# EAGLE board Nosumor (EAGLE 9.5.2)
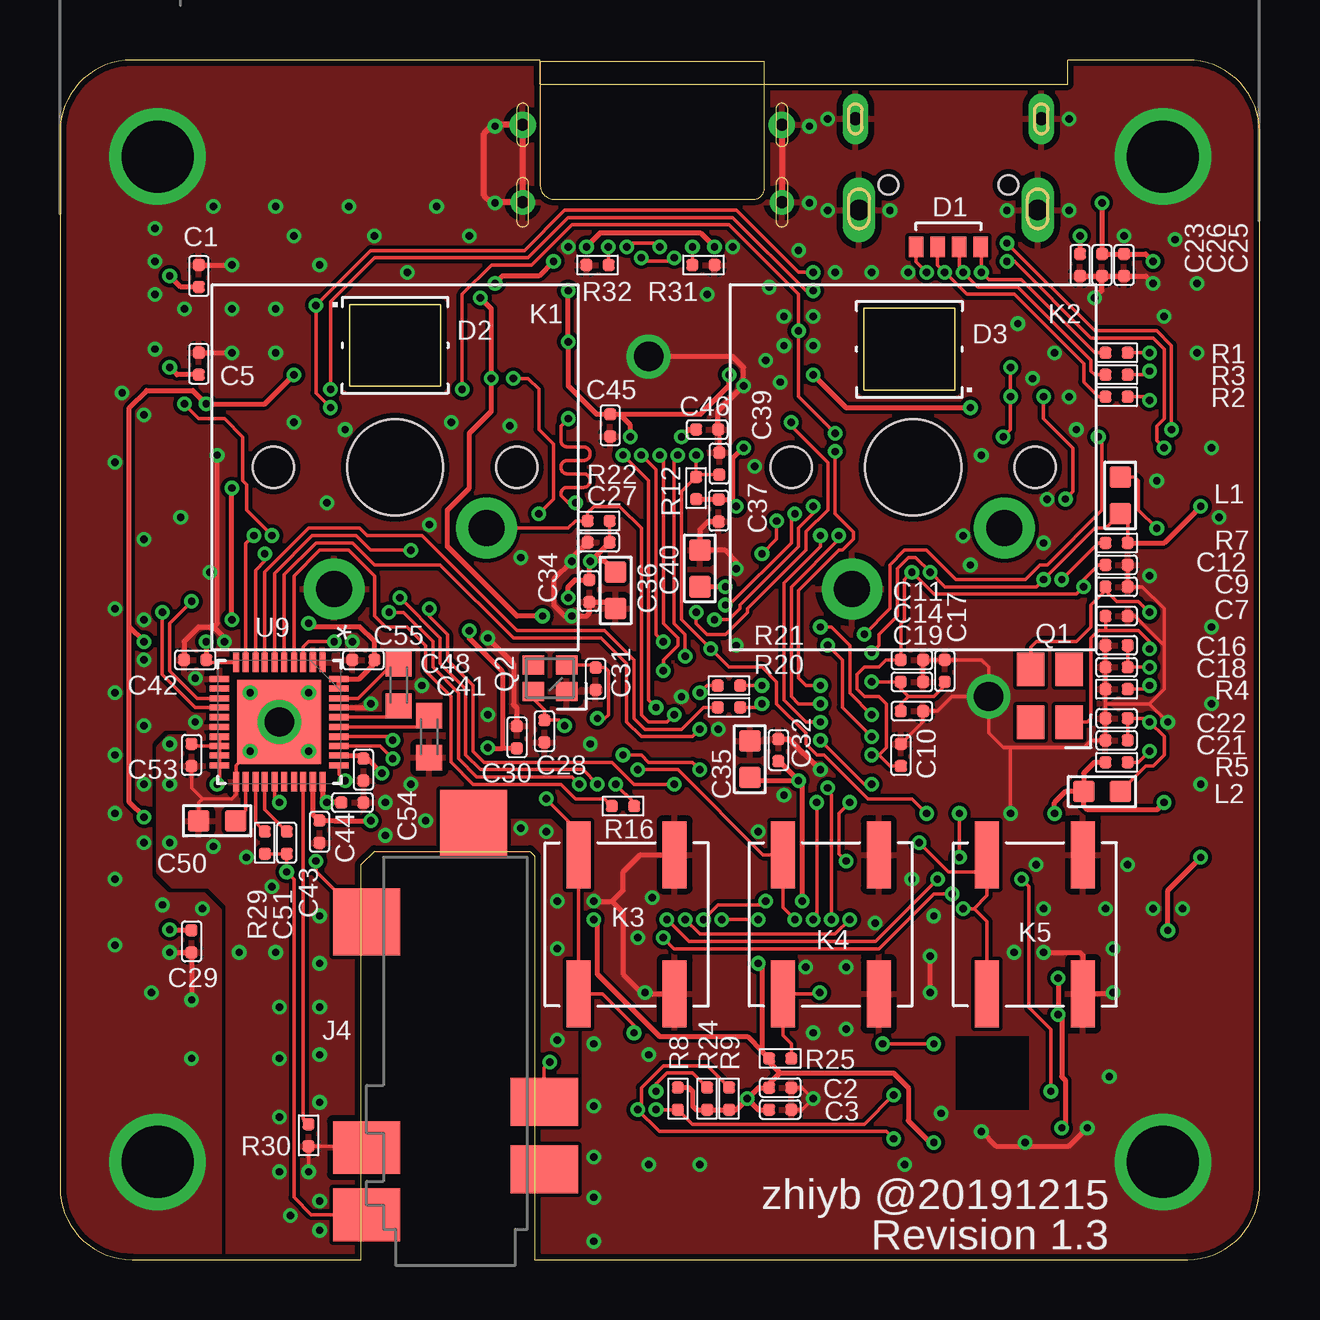
[diagram p1: board, top side]
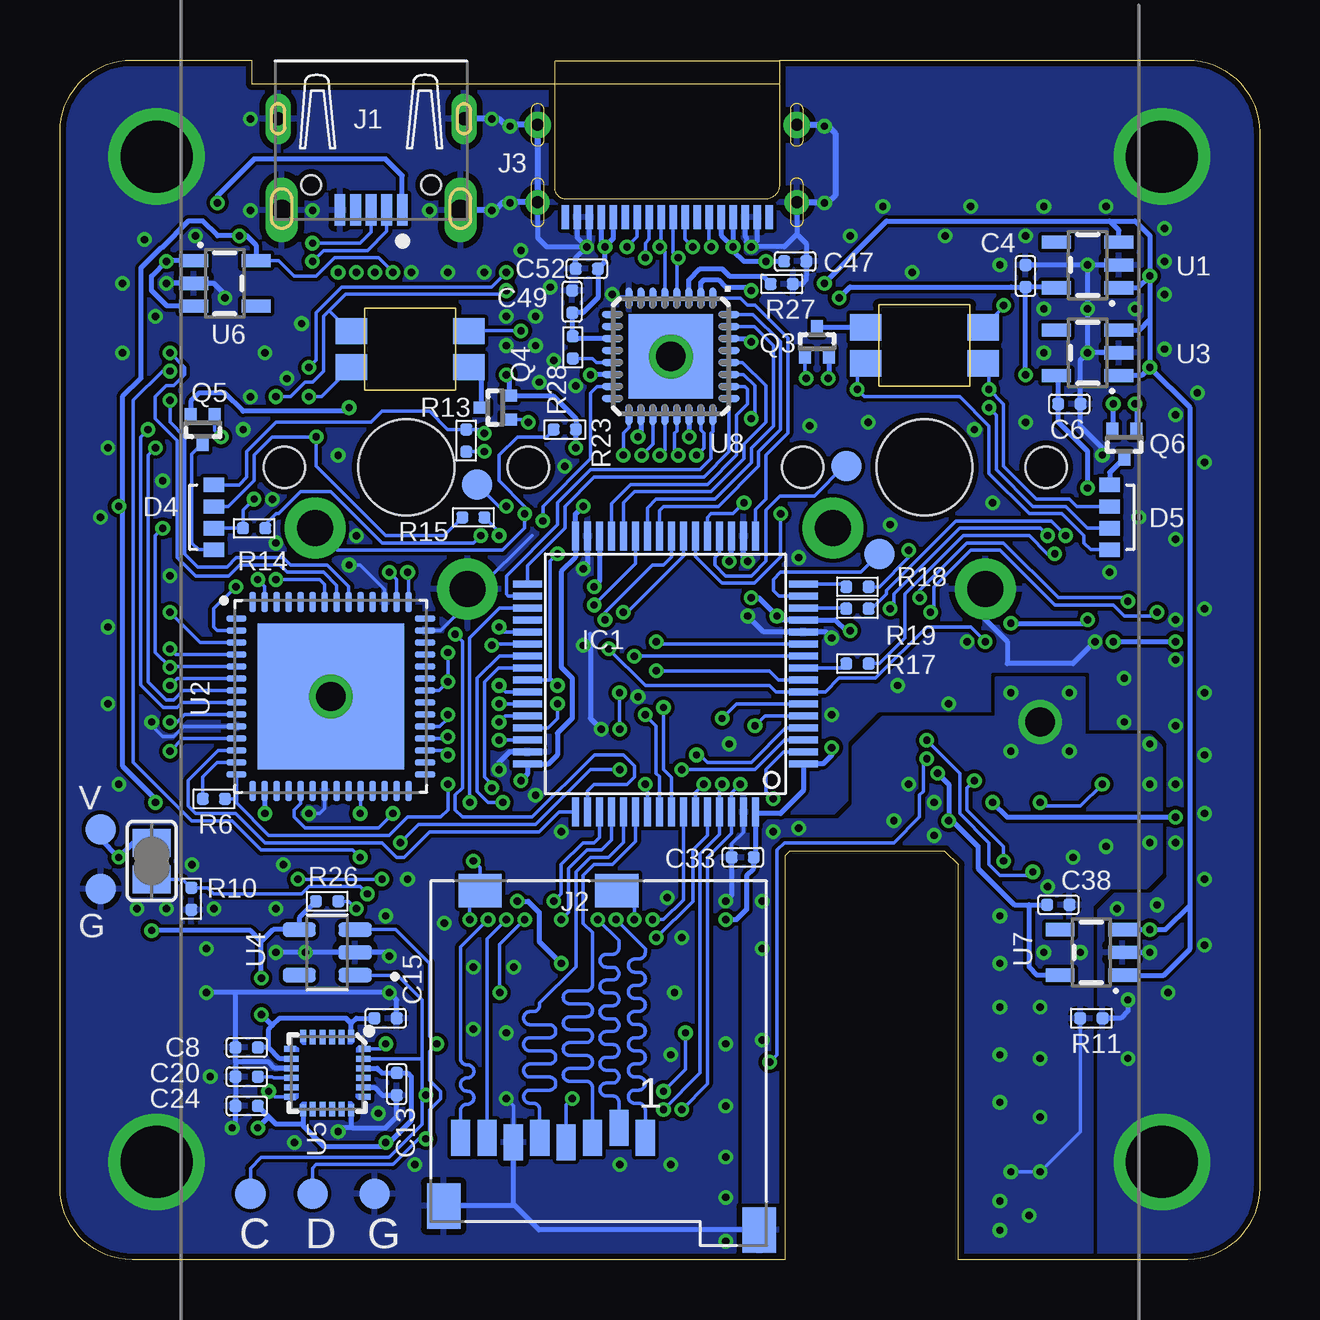
[diagram p2: board, bottom side, seen from below]

Size 50 x 50 mm. Coordinates in mm from the lower left corner, seen from the top.
Outline: 0,3 arc90 3,0 12.55,0 12.55,16.46 13.11,17.02 19.58,17.02 19.79,16.82 19.79,0 47,0 arc90 50,3 50,47 arc90 47,50 42,50 42,49 20,49 20,50 3,50 arc90 0,47 0,3
Copper layers (1*16): Top 0.035mm / dielectric 1.5mm / Bottom 0.035mm
Design rules "SeeedStudio_2layer_DRU_no_angle_20140221": minimum track width 6mil, minimum drill 12mil, track to track 6mil, track to pad 6mil, pad to pad 6mil, via to via 6mil, smd to smd 0mil, copper to edge 10mil, drill to drill 10mil, minimum pad ring 10mil, minimum via ring 6mil, stop-mask expansion 2mil, vias tented up to drill 100mil, thermal gap 10mil
tRestrict: area 37.3,6.2 to 40.4,9.3; area 12.5,0 to 19.8,17.1; area 7,20.3 to 11.3,24.5
bRestrict: area 37.3,6.2 to 40.4,9.3; area 34.9,19.7 to 42.5,27.3; area 22.6,35.2 to 26.8,39.5

## Footprints (pad centres in the part's own frame; a part is rotated, then mirrored left to right if it is on the bottom)
C0402 = smd 0.5 x 0.5: 1 0,0.463; 2 0,-0.463
C0603 = smd 0.889 x 0.889: 1 0,0.762; 2 0,-0.762
C0603K = smd 1.05 x 1.08: 1 -0.875,0; 2 0.875,0
1105 = smd 0.6 x 0.85: B -0.45,0; CA 1.35,0; G 0.45,0; R -1.35,0
HSMF-A3-BACK = smd 1.1 x 1.3 bottom: 1 -0.75,-2.45; 2 -0.75,2.45; 3 0.75,2.45; 4 0.75,-2.45
LQFP64 = smd 0.3 x 1.2: 1 -3.75,-5.75; 2 -3.25,-5.75; 3 -2.75,-5.75; 4 -2.25,-5.75; 5 -1.75,-5.75; 6 -1.25,-5.75; 7 -0.75,-5.75; 8 -0.25,-5.75; 9 0.25,-5.75; 10 0.75,-5.75; 11 1.25,-5.75; 12 1.75,-5.75; 13 2.25,-5.75; 14 2.75,-5.75; 15 3.25,-5.75; 16 3.75,-5.75; 33 3.75,5.75; 34 3.25,5.75; 35 2.75,5.75; 36 2.25,5.75; 37 1.75,5.75; 38 1.25,5.75; 39 0.75,5.75; 40 0.25,5.75; 41 -0.25,5.75; 42 -0.75,5.75; 43 -1.25,5.75; 44 -1.75,5.75; 45 -2.25,5.75; 46 -2.75,5.75; 47 -3.25,5.75; 48 -3.75,5.75 | smd 1.2 x 0.3: 17 5.75,-3.75; 18 5.75,-3.25; 19 5.75,-2.75; 20 5.75,-2.25; 21 5.75,-1.75; 22 5.75,-1.25; 23 5.75,-0.75; 24 5.75,-0.25; 25 5.75,0.25; 26 5.75,0.75; 27 5.75,1.25; 28 5.75,1.75; 29 5.75,2.25; 30 5.75,2.75; 31 5.75,3.25; 32 5.75,3.75; 49 -5.75,3.75; 50 -5.75,3.25; 51 -5.75,2.75; 52 -5.75,2.25; 53 -5.75,1.75; 54 -5.75,1.25; 55 -5.75,0.75; 56 -5.75,0.25; 57 -5.75,-0.25; 58 -5.75,-0.75; 59 -5.75,-1.25; 60 -5.75,-1.75; 61 -5.75,-2.25; 62 -5.75,-2.75; 63 -5.75,-3.25; 64 -5.75,-3.75
629105150521 = smd 0.45 x 1.3: 1 -1.3,3.8; 2 -0.65,3.8; 3 0,3.8; 4 0.65,3.8; 5 1.3,3.8 | drill 0.85 pad 1.2 long: Z1 -3.725,3.8; Z2 3.725,3.8 | drill 0.55 pad 0.9 long: Z3 3.875,0; Z4 -3.875,0 | hole 0.8: -2.5,2.75; 2.5,2.75
693071010811 = smd 0.8 x 1.5: 1 0,0; 2 1.1,-0.4; 3 2.2,0; 4 3.3,0.2; 5 4.4,0; 6 5.5,0.2; 7 6.6,0; 8 7.7,0 | smd 1.4 x 1.9: 9 -4.75,3.85; 9-1 8.4,2.85 | smd 1.8 x 1.4: 10 1.19,-10.3; 10-1 6.89,-10.3
CX90M-16P = smd 0.3 x 1: A1 -3.75,0.75; A4 -2.75,0.75; A5 -1.75,0.75; A6 -0.75,0.75; A7 0.75,0.75; A8 1.75,0.75; A9 2.75,0.75; A12 3.75,0.75; B1 3.25,0.75; B4 2.25,0.75; B5 1.25,0.75; B6 0.25,0.75; B7 -0.25,0.75; B8 -1.25,0.75; B9 -2.25,0.75; B12 -3.25,0.75; NC1 -4.25,0.75; NC2 4.25,0.75 | drill 0.5 pad 1: Z1 5.4,0.13; Z2 -5.4,0.13 | drill 0.5 pad 1.1: Z3 -5.4,-3.1; Z4 5.4,-3.1
SJ-4351*-SMT-MIRRORED-EDGE = smd 2.2 x 2.8: 1 0.6,3.7; 4 3.4,3.7 | smd 2.8 x 2.8: 2 12.8,3.7; 5 16.9,-0.75 | smd 2 x 2.8: 3 5.3,-3.7; 6 2.5,-3.7
CHERRY-MX = drill 1.5 pad 2.54: SW1 -3.81,2.54; SW2 2.54,5.08 | hole 4: 0,0 | hole 1.714: -5.08,0; 5.08,0
KSC-J = smd 2.8 x 1: 1 -2.9,2; 2 -2.9,-2; 3 2.9,2; 4 2.9,-2
L0603 = smd 0.889 x 0.889: 1 -0.762,0; 2 0.762,0
ABM8W = smd 1.4 x 1.15: P$1 0,0; P$2 2.2,0; P$3 2.2,1.6; P$4 0,1.6
CX2016DB = smd 0.9 x 0.8: 1 -0.7,-0.55; 2 0.7,-0.55; 3 0.7,0.55; 4 -0.7,0.55
SC-89 = smd 0.5 x 0.66: 1 -0.5,-0.57; 2 0,0.57; 3 0.5,-0.57
R0402 = smd 0.5 x 0.5: 1 0,0.463; 2 0,-0.463
SJ = smd 1.168 x 1.6: 1 -0.762,0; 2 0.762,0
B1,27 = smd 1.27 x 1.27: TP 0,0
SOT23-5 = smd 0.55 x 1.2: 1 -0.95,-1.3; 2 0,-1.3; 3 0.95,-1.3; 4 0.95,1.3; 5 -0.95,1.3
QFN50P800X800X100-57N = smd 0.85 x 0.27: 1 -3.935,3.25; 2 -3.935,2.75; 3 -3.935,2.25; 4 -3.935,1.75; 5 -3.935,1.25; 6 -3.935,0.75; 7 -3.935,0.25; 8 -3.935,-0.25; 9 -3.935,-0.75; 10 -3.935,-1.25; 11 -3.935,-1.75; 12 -3.935,-2.25; 13 -3.935,-2.75; 14 -3.935,-3.25; 29 3.935,-3.25; 30 3.935,-2.75; 31 3.935,-2.25; 32 3.935,-1.75; 33 3.935,-1.25; 34 3.935,-0.75; 35 3.935,-0.25; 36 3.935,0.25; 37 3.935,0.75; 38 3.935,1.25; 39 3.935,1.75; 40 3.935,2.25; 41 3.935,2.75; 42 3.935,3.25 | smd 0.27 x 0.85: 15 -3.25,-3.935; 16 -2.75,-3.935; 17 -2.25,-3.935; 18 -1.75,-3.935; 19 -1.25,-3.935; 20 -0.75,-3.935; 21 -0.25,-3.935; 22 0.25,-3.935; 23 0.75,-3.935; 24 1.25,-3.935; 25 1.75,-3.935; 26 2.25,-3.935; 27 2.75,-3.935; 28 3.25,-3.935; 43 3.25,3.935; 44 2.75,3.935; 45 2.25,3.935; 46 1.75,3.935; 47 1.25,3.935; 48 0.75,3.935; 49 0.25,3.935; 50 -0.25,3.935; 51 -0.75,3.935; 52 -1.25,3.935; 53 -1.75,3.935; 54 -2.25,3.935; 55 -2.75,3.935; 56 -3.25,3.935 | smd 6.1 x 6.1: 57 0,0
SOT95P280X145-5N = smd 1.39 x 0.6: 1 -1.165,0.95; 2 -1.165,0; 3 -1.165,-0.95; 4 1.165,-0.95; 5 1.165,0.95
QFN24-3X3 = smd 0.495 x 0.25: 1 -1.552,1; 6 -1.552,-1; 13 1.552,-1; 18 1.552,1 | smd 0.6 x 0.25: 2 -1.5,0.6; 3 -1.5,0.2; 4 -1.5,-0.2; 5 -1.5,-0.6; 14 1.5,-0.6; 15 1.5,-0.2; 16 1.5,0.2; 17 1.5,0.6 | smd 0.25 x 0.495: 7 -1,-1.552; 12 1,-1.552; 19 1,1.552; 24 -1,1.552 | smd 0.25 x 0.6: 8 -0.6,-1.5; 9 -0.2,-1.5; 10 0.2,-1.5; 11 0.6,-1.5; 20 0.6,1.5; 21 0.2,1.5; 22 -0.2,1.5; 23 -0.6,1.5
QFN32 = smd 0.9 x 0.3: 1 -2.427,1.75; 2 -2.427,1.25; 3 -2.427,0.75; 4 -2.427,0.25; 5 -2.427,-0.25; 6 -2.427,-0.75; 7 -2.427,-1.25; 8 -2.427,-1.75; 17 2.427,-1.75; 18 2.427,-1.25; 19 2.427,-0.75; 20 2.427,-0.25; 21 2.427,0.25; 22 2.427,0.75; 23 2.427,1.25; 24 2.427,1.75 | smd 0.3 x 0.9: 9 -1.75,-2.427; 10 -1.25,-2.427; 11 -0.75,-2.427; 12 -0.25,-2.427; 13 0.25,-2.427; 14 0.75,-2.427; 15 1.25,-2.427; 16 1.75,-2.427; 25 1.75,2.427; 26 1.25,2.427; 27 0.75,2.427; 28 0.25,2.427; 29 -0.25,2.427; 30 -0.75,2.427; 31 -1.25,2.427; 32 -1.75,2.427 | smd 3.53 x 3.53: EXP 0,0
QFN40P500X500X80-41N = smd 0.813 x 0.254: 1 -2.489,1.803; 2 -2.489,1.397; 3 -2.489,0.991; 4 -2.489,0.61; 5 -2.489,0.203; 6 -2.489,-0.203; 7 -2.489,-0.61; 8 -2.489,-0.991; 9 -2.489,-1.397; 10 -2.489,-1.803; 21 2.489,-1.803; 22 2.489,-1.397; 23 2.489,-0.991; 24 2.489,-0.61; 25 2.489,-0.203; 26 2.489,0.203; 27 2.489,0.61; 28 2.489,0.991; 29 2.489,1.397; 30 2.489,1.803 | smd 0.254 x 0.813: 11 -1.803,-2.489; 12 -1.397,-2.489; 13 -0.991,-2.489; 14 -0.61,-2.489; 15 -0.203,-2.489; 16 0.203,-2.489; 17 0.61,-2.489; 18 0.991,-2.489; 19 1.397,-2.489; 20 1.803,-2.489; 31 1.803,2.489; 32 1.397,2.489; 33 0.991,2.489; 34 0.61,2.489; 35 0.203,2.489; 36 -0.203,2.489; 37 -0.61,2.489; 38 -0.991,2.489; 39 -1.397,2.489; 40 -1.803,2.489 | smd 3.5 x 3.5: 41 0,0

## Placement (x,y rotation side)
C1  4u7  [C0402]  5.79,41 0 top
C2  4u7  [C0402]  30.02,7.16 270 top
C3  100nf  [C0402]  30.02,6.25 90 top
C4  4u7  [C0402]  9.75,41 0 bottom
C5  4u7  [C0402]  5.79,37.34 0 top
C6  4u7  [C0402]  7.92,35.66 270 bottom
C7  4p  [C0402]  44.04,26.82 270 top
C8  100n  [C0402]  42.21,8.84 90 bottom
C9  4p  [C0402]  44.04,28.04 270 top
C10  100nf  [C0402]  35.05,21.03 0 top
C11  4u7  [C0402]  35.51,24.99 270 top
C12  100nf  [C0402]  44.04,28.96 270 top
C13  100n  [C0402]  35.97,7.32 180 bottom
C14  100nf  [C0402]  35.51,24.08 270 top
C15  100n  [C0402]  36.42,10.06 270 bottom
C16  4u7  [C0402]  44.04,25.6 90 top
C17  100nf  [C0402]  36.88,24.54 0 top
C18  100nf  [C0402]  44.04,24.69 90 top
C19  100nf  [C0402]  35.51,22.86 270 top
C20  100n  [C0402]  42.21,7.62 90 bottom
C21  4u7  [C0402]  44.04,21.64 90 top
C22  100nf  [C0402]  44.04,22.56 90 top
C23  4u7  [C0402]  42.52,41.45 180 top
C24  100n  [C0402]  42.21,6.4 90 bottom
C25  4u7  [C0402]  44.35,41.45 180 top
C26  100nf  [C0402]  43.43,41.45 180 top
C27  100n  [C0402]  22.45,29.9 90 top
C28  12pf  [C0402]  20.19,22.02 180 top
C29  4u7  [C0402]  5.49,13.26 180 top
C30  100n  [C0402]  19.05,21.77 0 top
C31  12pf  [C0402]  22.33,24.21 180 top
C32  100n  [C0402]  29.95,21.23 0 top
C33  100n  [C0402]  21.54,16.76 90 bottom
C34  100n  [C0402]  22.07,27.86 180 top
C35  4u7  [C0603]  28.75,20.85 0 top
C36  4u7  [C0603]  23.16,27.89 180 top
C37  100n  [C0402]  27.46,31.22 180 top
C38  4u7  [C0402]  8.38,14.78 270 bottom
C39  100n  [C0402]  27.48,33.17 0 top
C40  4u7  [C0603]  26.67,28.8 0 top
C41  2u2  [C0603K]  15.39,21.79 270 top
C42  100nf  [C0402]  5.64,24.99 90 top
C43  100nf  [C0402]  10.82,17.83 180 top
C44  100nf  [C0402]  12.19,19.05 270 top
C45  4u7  [C0402]  22.94,34.77 180 top
C46  4u7  [C0402]  26.97,34.59 270 top
C47  4u7  [C0402]  19.35,41.61 270 bottom
C48  2u2  [C0603K]  14.12,23.95 90 top
C49  100nf  [C0402]  28.65,39.93 0 bottom
C50  10uf  [C0603]  6.55,18.29 270 top
C51  100nf  [C0402]  9.45,17.37 0 top
C52  100nf  [C0402]  28.04,41.3 90 bottom
C53  100nf  [C0402]  5.49,21.03 0 top
C54  100nf  [C0402]  12.65,20.42 0 top
C55  100nf  [C0402]  12.65,24.99 270 top
D1  MSL0601RGB  [1105]  37.03,42.21 180 top
D2  HSMF-A3-BACK  [HSMF-A3-BACK]  13.97,38.1 270 top
D3  HSMF-A3-BACK  [HSMF-A3-BACK]  35.41,37.95 90 top
D4  MSL0601RGB  [1105]  43.59,30.94 270 bottom
D5  MSL0601RGB  [1105]  6.25,30.94 90 bottom
IC1  STM32F722RET  [LQFP64]  24.77,24.41 90 bottom
J1  [629105150521]  37.03,47.55 180 bottom
J2  [693071010811]  25.6,5.08 180 bottom
J3  CX90M-16P  [CX90M-16P]  24.69,44.2 180 bottom
J4  SJ-43515TS-SMT-EDGE  [SJ-4351*-SMT-MIRRORED-EDGE]  16.48,1.27 90 top
K1  CHERRY-MX  [CHERRY-MX]  13.97,33.02 180 top
K2  CHERRY-MX  [CHERRY-MX]  35.56,33.02 180 top
K3  KSC623J  [KSC-J]  23.62,13.97 90 top
K4  KSC623J  [KSC-J]  32.13,13.97 90 top
K5  KSC623J  [KSC-J]  40.64,13.97 90 top
L1  120OHM-500MA  [L0603]  44.2,31.85 270 top
L2  120OHM-500MA  [L0603]  43.43,19.51 180 top
Q1  ABM8W-12.0000MHZ  [ABM8W]  42.06,22.4 90 top
Q2  CX2016DB  [CX2016DB]  20.42,24.23 0 top
Q3  FDY100PZ  [SC-89]  18.44,38.25 0 bottom
Q4  FDY100PZ  [SC-89]  31.85,35.51 90 bottom
Q5  FDY100PZ  [SC-89]  44.04,34.59 180 bottom
Q6  FDY100PZ  [SC-89]  5.64,33.99 180 bottom
R1  330R  [R0402]  44.04,37.8 270 top
R2  330R  [R0402]  44.04,35.97 270 top
R3  330R  [R0402]  44.04,36.88 270 top
R4  12k 1%  [R0402]  44.04,23.77 270 top
R5  2k2  [R0402]  44.04,20.73 270 top
R6  330R  [R0402]  43.59,19.2 270 bottom
R7  10K 1/16W  [R0402]  44.04,29.87 90 top
R8  2k2  [R0402]  25.76,6.71 180 top
R9  2k2  [R0402]  27.89,6.71 0 top
R10  10K 1/16W  [R0402]  44.53,15.04 0 bottom
R11  0  [R0402]  7.01,10.06 270 bottom
R12  10K 1/16W  [R0402]  26.52,32.16 0 top
R13  100R  [R0402]  33.07,34.14 180 bottom
R14  100R  [R0402]  41.91,30.48 270 bottom
R15  100R  [R0402]  32.77,30.94 270 bottom
R16  27R  [R0402]  23.47,18.9 270 top
R17  27R  [R0402]  16.76,24.84 90 bottom
R18  27R  [R0402]  16.76,28.04 90 bottom
R19  27R  [R0402]  16.76,27.13 90 bottom
R20  27R  [R0402]  27.89,23.01 270 top
R21  10R  [R0402]  27.89,23.93 270 top
R22  10K 1/16W  [R0402]  22.45,30.78 90 top
R23  10K 1/16W  [R0402]  28.96,34.59 90 bottom
R24  10K 1/16W  [R0402]  26.97,6.71 0 top
R25  10K 1/16W  [R0402]  30.02,8.38 270 top
R26  10K 1/16W  [R0402]  38.86,14.94 270 bottom
R27  10K 1/16W  [R0402]  19.91,40.67 270 bottom
R28  20K  [R0402]  28.63,38.02 180 bottom
R29  2k7  [R0402]  8.53,17.37 0 top
R30  0  [R0402]  10.36,5.18 0 top
R31  5k1  [R0402]  26.82,41.45 270 top
R32  5k1  [R0402]  22.4,41.45 90 top
SJ1  [SJ]  46.18,16.61 270 bottom
TP1  TPB1,27  [B1,27]  39.47,2.74 0 bottom
TP2  TPB1,27  [B1,27]  17.22,33.07 0 bottom
TP4  TPB1,27  [B1,27]  48.31,15.44 90 bottom
TP5  TPB1,27  [B1,27]  42.06,2.74 0 bottom
TP6  TPB1,27  [B1,27]  15.85,29.41 0 bottom
TP8  TPB1,27  [B1,27]  48.31,17.93 90 bottom
TP9  TPB1,27  [B1,27]  36.88,2.74 180 bottom
TP10  TPB1,27  [B1,27]  32.61,32.31 0 bottom
U1  3.3V  [SOT23-5]  7.16,41.45 90 bottom
U2  FT2232H-56Q-REEL  [QFN50P800X800X100-57N]  38.71,23.47 0 bottom
U3  1.8V  [SOT23-5]  7.16,37.8 90 bottom
U4  24CW1280T-I/OT  [SOT95P280X145-5N]  38.86,12.8 180 bottom
U5  9DoF IMU  [QFN24-3X3]  38.86,7.77 270 bottom
U6  3.3V  [SOT23-5]  43.13,40.69 270 bottom
U7  1.8V  [SOT23-5]  7.01,12.8 90 bottom
U8  USB3370  [QFN32]  24.54,37.64 270 bottom
U9  TLV320AIC3256  [QFN40P500X500X80-41N]  9.14,22.4 270 top

## Tracks (layer width: path | path; a pad name or v marks a point on that pad's centre or on a via)
+1V8  (via drill 0.3)
  Top 0.203: U9.39 U9.40 12.47,24.21 13.11,24.85 C55.1 13.11,25.75 12.5,26.36 10.52,26.36 v10.36,26.52 | v7.16,26.67 v7.16,32.16
  Bottom 0.203: U3.5 8.39,36.77 C6.2 8.39,34.91 7.16,33.68 v7.16,32.16 | v10.36,26.52 7.32,26.52 v7.16,26.67
+3V3  (via drill 0.3)
  Top 0.152: R22.2 C27.2 | U9.10 6.2,24.89 C42.2
  Top 0.203: 22.13,29.11 v22.1,29.11 22.07,29.08 C34.2 21.47,28.33 21.18,28.04 v21.18,27.58 | 22.13,29.11 C27.2 | R12.2 26.53,31.68 C37.2 28.02,31.68 28.04,31.7 | C36.2 22.71,29.11 22.13,29.11 | v30.79,19.96 29.98,20.77 C32.2 | C35.2 28.88,19.96 v30.79,19.96 | v31.39,36.88 32.77,35.51 v37.95,35.51 | v28.65,6.71 29.11,7.16 C2.2 29.56,7.32 30.02,7.77 | v28.65,6.71 29.11,6.25 C3.1 | R8.2 26.21,7.17 26.36,7.01 26.36,6.4 26.52,6.24 R24.2 27.87,6.24 27.88,6.25 R9.2 28.19,6.24 v28.65,6.71 | v17.07,26.21 17.07,25.88 18.44,24.51 18.44,21.3 | C30.2 18.44,21.3 | 18.44,21.3 17.86,21.3 v17.83,21.34 | U9.30 10.95,19.23 v11.12,19.05 C44.2 | v30.79,19.96 30.94,19.81 v30.94,14.94 | v29.11,12.34 29.26,12.19 29.26,8.68 | 29.26,8.68 R25.2 29.56,8.23 30.02,7.77 | v22.25,14.17 22.4,14.02 22.4,11.89 24.99,9.3 28.65,9.3 29.26,8.68 | v17.53,40.08 17.98,39.62 v17.98,36.73 17.98,35.36 17.07,34.44 17.07,32.16 16.15,31.24 16.15,29.72 19.05,26.82 v20.12,26.82 | v9.75,36.88 8.53,35.66 v6.1,35.66 5.54,36.22 3.61,36.22 2.9,35.51 2.9,26.36 | v6.1,25.76 v6.1,25.75 C42.2 | v28.5,33.83 28.04,33.38 28.04,31.7 | v28.19,31.39 28.04,31.55 28.04,31.7 | v41.76,5.49 41.91,5.64 41.91,7.47 41.76,7.62 41.76,10.06 v41.6,10.21 v41.6,11.73 | 30.02,7.77 34.75,7.77 35.36,7.16 35.36,5.79 36.35,4.8 v36.42,4.88 | 2.9,26.36 2.9,19.05 v3.5,18.44 | v3.5,25.76 2.9,26.36 | v46.18,13.72 46.18,15.39 v47.55,16.76
  Bottom 0.152: J2.4 28.9,6.45 v28.65,6.71
  Bottom 0.203: v22.1,29.11 22.02,29.19 IC1.19 | v28.19,31.39 28.52,31.07 IC1.32 28.52,29.27 29.11,28.67 29.11,24.69 28.65,24.23 28.65,22.55 29.26,21.95 29.26,21.03 29.63,20.66 IC1.48 30.52,20.23 v30.79,19.96 | v28.5,33.83 v28.49,33.84 R23.2 28.49,35.05 29.46,36.01 Q4.3 31.28,36.77 v31.39,36.88 | v37.95,35.51 38.1,35.36 42.37,35.36 43.13,36.12 44.2,36.12 44.54,35.77 Q5.3 | v17.07,26.21 17.22,26.21 17.67,26.66 IC1.13 19.95,26.66 v20.12,26.82 20.88,27.58 v21.18,27.58 | v17.83,21.34 17.83,21.03 18.2,20.66 IC1.1 19.02,19.54 19.96,18.59 21.02,18.59 | v30.94,14.94 30.48,14.94 30.02,14.48 30.02,13.26 v29.11,12.34 | v22.25,14.17 21.79,14.17 21.38,14.59 21.38,16 21.08,16.31 C33.2 21.02,16.83 21.02,18.59 | IC1.64 21.02,18.59 | Q3.3 17.94,36.77 v17.98,36.73 | v17.53,40.08 17.07,40.54 10.36,40.54 10.36,40.53 C4.2 | U1.5 8.49,40.53 C4.2 | Q6.3 6.1,34.6 v6.1,35.66 | v9.75,36.88 C4.2 | v11.12,19.05 10.52,18.44 v3.5,18.44 | U5.22 36.78,7.97 36.58,7.78 C13.2 35.51,7.78 35.36,7.62 35.36,5.79 36.35,4.8 v36.42,4.88 36.58,4.72 39.01,4.72 39.86,5.57 39.86,5.64 | U5.8 40.83,8.37 41.3,8.84 | 41.3,8.84 C8.2 | U5.13 39.86,5.64 | C24.2 41.3,5.95 | U5.1 37.86,9.84 | 37.86,9.84 37.64,10.06 C15.2 | 37.86,9.84 38.08,10.06 40.84,10.06 41.15,9.75 | 41.3,8.84 41.3,9.6 41.15,9.75 | 41.15,9.75 v41.6,10.21 | v41.76,5.49 41.3,5.95 | R26.2 40.03,14.23 U4.4 41.11,13.75 41.6,13.26 | v41.6,11.73 41.6,13.26 | 41.6,13.26 42.06,13.72 v46.18,13.72 | 41.3,5.95 40.99,5.64 39.86,5.64 | v6.1,25.76 v3.5,25.76 | SJ1.1 46.94,17.37 v47.55,16.76 48.31,17.53 TP8.TP
+5V  (via drill 0.3)
  Top 0.203: v20.57,41.6 19.96,41 18.44,41 v18.14,40.69 | C1.2 5.04,40.53 v4.57,41 | C5.2 4.88,36.88 v4.57,37.19 | C29.2 4.6,13.72 v4.57,13.75 | v21.95,42.22 22.53,42.8 26.7,42.8 v27.28,42.22
  Bottom 0.203: J3.B9 22.44,42.71 v21.95,42.22 | J3.A4 v21.95,42.22 | J3.B4 26.94,42.56 v27.28,42.22 | J3.A9 27.44,42.37 v27.28,42.22 | v27.28,42.22 27.28,41.6 C52.2 27.58,40.09 28.2,39.47 C49.2 28.63,39.44 R28.2 28.53,38.39 U8.11 | v21.95,42.22 21.95,42.06 21.49,41.6 v20.57,41.6 C47.2 | v18.14,40.69 15.54,43.28 6.25,43.28 | v4.57,41 4.57,42.67 5.18,43.28 6.25,43.28 | v4.57,41 4.57,39.17 | 4.57,39.17 v4.57,37.19 | U3.1 4.91,36.84 v4.57,37.19 | U1.1 5.07,40.5 v4.57,41 | U7.3 v4.57,13.75 3.93,13.75 2.9,14.78 | v4.57,37.19 2.9,35.51 2.9,14.78 | 2.9,14.78 2.9,12.95 4,11.85 U7.1 | U3.3 4.99,38.74 4.57,39.17 | U1.3 5.86,42.9 6.25,43.28
ADC1
  Bottom 0.152: IC1.15 20.04,27.66 20.27,27.89 20.27,28.35 19.96,28.65 16.61,28.65 TP6.TP
ADC2  (via drill 0.3)
  Top 0.152: v27.28,26.67 27.89,26.67 28.35,27.13 28.35,27.28 30.79,29.72 30.79,30.48 31.39,31.09 v31.39,31.39
  Bottom 0.152: IC1.24 24.52,29.28 24.84,28.96 25.3,28.96 27.28,26.98 v27.28,26.67 | v31.39,31.39 31.7,31.39 TP10.TP
AGND  (via drill 0.3, 1.22)
  Top 0.152: U9.41 7.34,20.6 U9.21 7.34,19.38 7.16,19.2 5.94,19.2 | 5.94,19.2 5.79,19.05 C50.2 | C53.2 5.49,19.66 5.94,19.2 | J4.4 12.74,4.72 R30.2 v10.36,3.66
  Bottom 0.152: v10.36,3.66 v9.14,3.66 7.47,5.33 R11.2
  other vias: 20.27,17.83 20.73,12.95 20.73,9.14 15.24,18.29 14.63,19.81 13.56,17.68 8.84,15.54 6.4,17.22 9.14,22.4 10.82,14.33 10.82,12.34 10.82,8.53 10.82,2.44 10.82,1.22 9.6,1.83 9.14,5.94 9.14,10.52 8.99,12.8 4.57,17.37 4.57,21.49 4.57,19.81 7.77,16.76 10.36,21.18 7.92,21.18 19.2,17.98 13.56,19.05 7.47,12.8 10.82,10.52 9.14,8.38 10.82,6.55 7.92,23.62 10.36,23.62 20.73,14.94
  pour Top: 7.01,0 7.01,14.78 6.25,15.54 4.72,15.54 4.11,16.15 4.11,21.34 4.57,21.79 8.84,21.79 9.6,22.56 15.7,22.56 16.92,21.34 16.92,18.9 17.53,18.29 20.42,18.29 21.49,17.22 21.49,0
  pour Bottom: 7.01,0 7.01,14.78 6.25,15.54 4.72,15.54 4.11,16.15 4.11,21.34 4.57,21.79 8.84,21.79 9.6,22.56 15.7,22.56 16.92,21.34 16.92,18.9 17.53,18.29 20.42,18.29 21.49,17.22 21.49,0
  pour Bottom: 7.32,20.57 7.32,24.23 10.97,24.23 10.97,20.57
AIC_BCLK
  Bottom 0.152: IC1.16 17.34,28.16 R18.1
AIC_BCLK_R  (via drill 0.3)
  Top 0.152: U9.6 8.94,28.6 10.52,30.18 12.34,30.18 12.95,29.57 v14.63,29.57
  Bottom 0.152: R18.2 15.85,28.04 14.63,29.26 v14.63,29.57
AIC_DIN
  Bottom 0.152: IC1.9 17.41,24.66 R17.1
AIC_DIN_R  (via drill 0.3)
  Top 0.152: U9.8 8.15,28.73 8.53,29.11 v8.53,29.41
  Bottom 0.152: R17.2 15.84,24.84 14.78,25.9 14.78,27.74 12.34,30.18 9.6,30.18 8.84,29.41 v8.53,29.41
AIC_DOUT
  Bottom 0.152: IC1.14 17.26,27.16 R19.1
AIC_DOUT_R  (via drill 0.3)
  Top 0.152: v8.08,30.18 7.75,29.84 U9.9
  Bottom 0.152: R19.2 16.15,27.13 15.54,27.74 15.54,27.89 12.65,30.79 8.69,30.79 v8.08,30.18
AIC_GPIO  (via drill 0.3)
  Top 0.152: v23.16,19.81 23.93,19.05 R16.1
  Bottom 0.152: IC1.59 23.52,19.46 v23.16,19.81
AIC_GPIO_R
  Top 0.152: R16.2 22.7,19.2 21.49,19.2 20.88,19.81 17.23,19.81 16.31,20.73 16.31,23.47 15.24,24.54 15.24,25.6 14.48,26.36 13.56,26.36 13.11,26.82 13.11,28.5 12.04,29.57 10.82,29.57 9.75,28.5 U9.4
AIC_MCLK_R  (via drill 0.3)
  Top 0.152: U9.5 9.35,28.55 10.67,29.87 12.19,29.87 13.11,28.96 15.85,28.96 18.9,25.91 22.55,25.91 23.62,24.84 23.62,22.4 24.23,21.79 26.36,21.79 v26.67,22.1 | R21.2 26.98,23.93 v26.68,23.63 v26.68,23.62
  Bottom 0.152: v26.68,23.62 v26.68,22.1 v26.67,22.1
AIC_WCLK  (via drill 0.3)
  Top 0.152: R20.1 29.11,23.01 v29.26,23.16
  Bottom 0.152: IC1.45 29.66,22.16 29.26,22.55 v29.26,23.16
AIC_WCLK_R
  Top 0.152: U9.7 8.53,28.65 10.36,30.48 12.5,30.48 12.8,30.18 15.09,30.18 19.05,26.21 22.71,26.21 23.93,24.99 23.93,22.55 24.38,22.1 25.9,22.1 26.82,23.01 R20.2
AVDD  (via drill 0.3)
  Top 0.203: U9.32 12.53,21.01 C54.1 12.8,20.88 v13.41,20.27 | U9.29 10.54,18.57 C43.2 11.43,18.29 v12.95,18.29
  Bottom 0.203: U7.5 9.26,11.85 9.6,12.19 9.6,14.78 9.61,14.78 | 9.61,14.78 C38.2 | v13.41,20.27 12.95,19.81 v12.95,18.29 12.8,18.29 11.73,17.22 11.73,16.31 10.21,14.78 9.61,14.78
BOOT0  (via drill 0.3)
  Top 0.152: v25.15,13.41 25.6,12.95 34.14,12.95 36.42,15.24 v37.19,15.24
  Bottom 0.152: IC1.60 23.02,17.68 23.62,17.07 23.62,14.94 v25.15,13.41 | v37.19,15.24 37.49,15.54 39.62,15.54 39.93,15.24 43.59,15.24 43.85,15.5 R10.1 44.88,15.85 SJ1.2
DAC
  Bottom 0.152: IC1.20 22.52,29.45 22.71,29.26 22.71,28.96 22.25,28.5 21.18,28.5 20.57,29.11 20.57,31.24 19.98,31.83 18.56,31.83 17.32,33.07 TP2.TP
DBG_1V8  (via drill 0.3)
  Top 0.152: C12.2 43.28,28.96 42.67,28.35 v42.67,28.04 42.37,27.74 36.42,27.74 v35.51,28.65 35.2,28.35 35.2,26.67 35.05,26.51 C11.2 34.44,24.99 34.13,24.69 33.53,24.69 33.22,24.38 33.22,23.77 33.53,23.47 34.14,23.47 34.44,23.16 34.44,21.34 34.14,21.03 | C10.2 34.6,20.57 34.14,21.03 | 34.14,21.03 v33.83,21.03
  Bottom 0.152: U2.2 43.44,26.22 43.59,26.36 43.59,27.13 v42.67,28.04 | U2.43 35.46,28.6 v35.51,28.65 | U2.31 34.02,21.22 v33.83,21.03
DBG_3V3  (via drill 0.3)
  Top 0.152: v33.83,24.08 C14.2 35.05,23.78 35.36,23.47 | C19.2 35.05,23.16 35.36,23.47 | C17.2 36.88,23.93 36.42,23.47 35.36,23.47 | v33.83,25.3 34.14,25.6 34.14,26.06 34.9,26.82 34.9,28.8 35.36,29.26 35.66,29.26 v36.27,28.65 36.88,28.04 40.69,28.04 v41,28.35 43.13,30.48 43.59,30.48 L1.2 44.5,30.79 R7.2 | D1.CA 35.68,41.58 v36.12,41.15
  Top 0.203: v41.45,18.59 41.45,19.05 41.91,19.51 L2.2 | R5.2 43.12,20.73 42.67,20.27 L2.2 | v42.52,42.67 C23.2 | L2.2 42.67,18.9 42.82,18.75 45.72,18.75 v46.02,19.05 | R7.2 46.03,29.87 v47.55,31.39
  Bottom 0.152: v41,28.35 39.17,28.35 38.96,28.14 U2.50 | U2.44 35.96,28.34 v36.27,28.65 | U2.36 34.19,23.72 v33.83,24.08 v33.83,25.3 | v36.12,41.15 36.73,41.76 38.56,41.76 39.32,41 40.23,41 40.88,41.64 U6.5
  Bottom 0.203: U2.16 v41.46,18.6 v41.45,18.59 | U6.5 41.83,42.29 42.22,42.67 v42.52,42.67 43.43,42.67 44.04,43.28 44.65,43.28 45.77,42.16 45.8,42.16 46.63,41.33 46.63,36.73 47.4,35.97 47.4,31.55 v47.55,31.39 47.4,31.24 47.4,20.57 46.02,19.2 v46.02,19.05
DBG_DM  (via drill 0.3)
  Top 0.152: v46.02,33.83 45.72,34.14 45.72,34.75 46.02,35.05 46.02,37.95 45.57,38.41 42.98,38.41 39.78,41.6 v39.47,41.6
  Bottom 0.152: U2.7 44.86,23.72 45.26,23.32 45.57,23.32 46.33,24.08 46.33,33.53 v46.02,33.83 | J1.2 36.38,42.87 37.19,42.06 39.01,42.06 v39.47,41.6
DBG_DP  (via drill 0.3)
  Top 0.152: v46.33,34.59 46.33,38.1 45.72,38.71 43.13,38.71 v39.47,42.37
  Bottom 0.152: U2.8 44.9,23.22 45.11,23.01 45.69,23.01 46.63,23.95 46.63,34.29 v46.33,34.59 | J1.3 37.03,42.82 37.49,42.37 v39.47,42.37
DBG_RX_LED  (via drill 0.3)
  Top 0.152: v45.41,35.81 45.26,35.97 R2.1
  Bottom 0.152: U2.48 37.96,28.05 38.86,28.96 40.39,28.96 40.69,29.26 42.65,29.26 43.04,28.87 44.26,28.87 44.81,29.41 44.81,34.29 45.41,34.9 v45.41,35.81
DBG_RXD  (via drill 0.3)
  Top 0.152: v33.83,22.71 32.92,23.62 32.92,25.6 32.16,26.36 v31.7,26.36
  Bottom 0.152: v33.83,22.71 33.83,22.55 34.17,22.22 U2.33 | IC1.37 31.49,26.16 v31.7,26.36
DBG_SWD_LED  (via drill 0.3)
  Top 0.152: v37.49,18.59 v37.49,16.76 | R3.1 45.26,36.88 v45.41,37.03
  Bottom 0.152: U2.24 37.46,18.62 v37.49,18.59 | v37.49,16.76 37.8,17.07 41.6,17.07 42.82,18.29 44.5,18.29 46.94,20.73 46.94,35.81 45.72,37.03 v45.41,37.03
DBG_TX_LED  (via drill 0.3)
  Top 0.152: v45.41,37.8 R1.1
  Bottom 0.152: v45.41,37.8 44.81,37.19 44.81,36.88 45.26,36.42 45.57,36.42 46.02,35.97 46.02,35.05 45.11,34.14 45.11,29.26 44.35,28.5 42.98,28.5 42.52,28.96 40.84,28.96 40.54,28.65 39.01,28.65 38.46,28.1 U2.49
DBG_TXD  (via drill 0.3)
  Top 0.152: v32,25.6 32.61,24.99 32.61,23.01 v33.83,21.79
  Bottom 0.152: v33.83,21.79 33.91,21.72 U2.32 | IC1.38 31.95,25.66 v32,25.6
GND  (via drill 0.3, 1.22, 3)
  Top 0.152: C39.1 27.48,34.55 C46.1 | 43.58,23.16 C22.1 C21.1 42.97,21.64 42.67,21.34 39.62,21.34 | 43.58,23.16 R4.2 C18.1 C16.1 | 43.58,23.16 45.41,23.16 | 45.41,23.16 v46.18,22.4 | 45.41,23.16 46.02,23.77 46.02,25.6 | C7.1 44.81,26.82 46.02,25.6 | 46.02,25.6 46.02,27.13 45.11,28.04 C9.1 C12.1 | C14.1 C11.1 C17.1 38.4,25 38.71,24.69 U2.57 | C10.1 35.97,22.41 C19.1 36.58,22.86 37.19,23.47 U2.57 | U2.57 38.71,21.95 39.32,21.34 39.62,21.34 | v39.62,18.59 39.62,21.34 | C3.2 30.94,6.25 v31.39,6.71 30.94,7.16 C2.1
  Top 0.203: C27.1 21.34,29.24 v21.34,29.1 20.57,28.34 20.57,27.28 21.03,26.82 v21.34,26.82 21.95,26.82 22.07,26.95 C34.1 | v28.19,28.8 28.19,29.1 27.73,29.57 C40.1 26.67,30.42 27,30.75 C37.1 | C32.1 30.4,21.7 31.67,20.42 v31.7,20.42 | C26.1 C25.1 45.27,40.99 v45.57,40.69 | C23.1 C26.1 | v43.13,40.08 43.43,40.39 C26.1 | v22.25,14.94 23.01,14.94 | K3.4 24.18,16.87 23.47,16.15 23.47,15.39 23.01,14.94 | 23.01,14.94 23.47,14.48 23.47,11.89 24.29,11.07 K3.2 | 22.02,27.35 C34.1 | C34.1 22.89,27.4 C36.1 | C30.1 19.05,22.99 18.9,23.14 18.9,24.84 v17.83,25.91 | C46.1 27.44,35.36 v28.5,36.42 28.5,37.19 28.04,37.64 U8.EXP | C1.1 v7.16,41.46 | C5.1 v7.16,37.8 | U9.37 12.8,23.01 v12.95,23.16 | v6.86,25.76 6.86,25.91 6.4,26.36 | 6.4,26.36 5.79,26.36 5.18,25.75 C42.1 | v4.57,12.8 C29.1 v5.49,10.82 | 6.4,26.36 6.55,26.52 v6.55,33.53 | v12.19,25.75 v12.19,25.76 | v36.27,11.12 v36.27,12.65 | v43.89,11.12 43.84,11.07 K5.2 42.64,12.68 42.52,12.8 v41,12.8 | v38.41,5.33 39.01,4.72 42.06,4.72 v42.82,5.49
  Top 0.254: J3.Z4 J3.Z1 | J3.Z3 18.04,47.3 17.68,46.94 17.68,44.35 17.96,44.07 J3.Z2 J3.Z3
  Bottom 0.152: U2.10 44.84,22.22 45.26,21.79 45.72,21.79 46.18,22.25 v46.18,22.4 | U2.41 34.13,26.22 33.02,27.33 K2.SW2 32.56,27.94 30.33,30.18 | U2.45 36.46,27.93 37.48,28.95 v37.95,28.95 | U2.21 38.96,18.8 39.17,18.59 v39.62,18.59 | IC1.63 21.52,17.8 22,17.32 C33.1 | J2.6 31.1,6.41 v31.39,6.71
  Bottom 0.203: J3.B1 27.94,42.32 v28.04,42.22 | J3.A12 28.44,42.61 v28.04,42.22 | C52.1 28.5,41.75 v28.04,42.22 | 21.06,42.22 v21.18,42.22 | U8.8 26.81,40.07 v26.98,40.23 | v21.34,29.1 21.52,29.28 IC1.18 | IC1.31 28.02,28.98 v28.19,28.8 28.35,28.64 | J3.Z2 19.29,42.74 | 19.29,42.74 19.81,42.22 v21.18,42.22 | J3.Z1 30.09,42.59 29.72,42.22 v28.04,42.22 | 19.29,42.74 18.89,42.34 C47.1 18.89,41 18.9,41 18.9,40.84 19.07,40.66 R27.1 | IC1.47 31.27,21.16 31.7,20.73 v31.7,20.42 | v45.57,40.69 U6.2 43.59,40.69 43.13,40.23 v43.13,40.08 | C33.1 22,15.18 v22.25,14.94 | v21.34,26.82 20.67,26.16 IC1.12 18.08,26.16 v17.83,25.91 | 27.89,26.06 27.89,22.55 v27.43,22.1 | J2.9 30.03,1.23 31.03,2.23 | J2.6 31.1,2.3 31.03,2.23 | 31.03,2.23 J2.9-1 | U1.2 v7.16,41.46 | v7.16,41.46 C4.1 | U3.2 v7.16,37.8 | v7.16,37.8 v7.16,41.46 | v7.16,37.8 7.46,37.5 C6.1 7.46,34.74 6.55,33.83 v6.55,33.53 | U7.2 v4.57,12.8 | v5.49,10.82 5.49,10.36 5.79,10.06 R11.1 | v6.86,25.76 7.77,24.84 10.52,24.84 10.52,25.76 11.43,26.67 K1.SW2 | U5.20 36.89,7.17 36.57,6.85 C13.1 35.97,5.94 36.42,5.49 37.8,5.49 | U5.9 41.04,7.97 41.3,8.23 42.68,8.23 | 42.68,8.23 C8.1 42.68,11.12 42.67,11.12 | 42.68,8.23 C20.1 C24.1 42.68,5.63 v42.82,5.49 | U5.18 37.86,5.55 37.8,5.49 | C15.1 35.96,10.81 v36.27,11.12 42.67,11.12 | v36.27,12.65 36.42,12.8 U4.2 v41,12.8 | 42.67,11.12 v43.89,11.12 | 37.8,5.49 38.25,5.49 v38.41,5.33 | J3.B12 21.44,42.65 21.39,42.6 21.39,42.42 v21.18,42.22 | J3.A1 20.94,42.46 v21.18,42.22
  Bottom 0.254: J3.Z2 17.96,44.07 17.68,44.35 17.68,46.94 18.04,47.3 J3.Z3 | J1.Z4 31.7,47.55 31.45,47.3 J3.Z4 J3.Z1 31.52,44.07 31.85,43.74 33.3,43.74 J1.Z1
  other vias: 4.06,45.97 45.97,45.97 4.06,4.06 45.97,4.06 24.54,37.64 38.71,23.47 22.1,21.49 5.64,22.4 4.27,14.78 5.94,14.63 3.81,11.13 5.49,8.38 2.29,13.11 2.29,15.85 3.51,17.37 2.29,18.59 3.51,19.81 2.29,21.03 3.51,22.25 2.29,23.62 3.51,24.99 2.29,27.13 3.51,30.02 2.29,33.22 3.51,35.2 2.59,36.12 3.96,37.95 3.96,41.61 9.75,34.9 11.13,31.55 16.31,34.9 15.39,30.63 18.75,34.75 19.2,29.26 11.89,34.59 28.19,25.6 38.4,33.52 37.64,30.17 41.15,31.69 41,29.86 40.69,16.46 15.09,23.93 29.41,37.48 30.18,38.09 31.39,39.31 31.39,38.09 30.18,39.31 29.57,40.53 30.78,42.06 32.31,41.14 35.36,41.14 33.83,41.14 34.59,43.73 39.47,43.73 42.06,43.73 32,43.73 31.24,44.04 31.24,47.24 32,47.54 42.06,47.54 18.14,44.04 18.14,47.24 39.93,39.01 40.54,36.72 42.06,35.96 41.45,37.79 46.02,39.31 44.35,42.67 46.48,42.51 47.4,40.68 47.4,37.79 28.96,33.06 30.02,36.57 24.08,13.41 24.38,11.13 24.54,8.53 22.25,8.99 22.25,6.4 22.25,4.27 22.25,0.76 22.25,2.59 31.39,9.45 31.09,12.19 33.99,14.02 40.23,4.88 36.73,6.1 7.16,39.62 10.82,41.45 14.48,41.15 13.11,42.67 12.04,43.89 15.7,43.89 17.07,42.67 9.75,42.67 8.99,43.89 6.4,43.89 3.96,42.98 8.99,37.8 8.99,39.62 5.18,39.62 5.03,30.94 29.11,17.83 24.69,15.09 35.51,15.85 32.77,9.6 32.77,12.19 25.91,23.46 30.18,19.35 35.2,3.96 24.54,3.96 26.67,3.96 36.42,14.33 39.78,12.8 41,14.63 45.57,14.63 44.5,16.46 47.55,19.81 46.79,14.63 43.59,14.63 43.89,12.95 43.74,7.62 48.01,26.37 48.01,33.83 48.31,30.94 48.01,23.16 3.51,26.67 6.25,28.65 17.83,22.71 45.72,32.46 42.37,34.59 45.42,28.5 5.64,24.23 3.96,40.23
  pour Top (rank 2): 0,0 49.99,0 49.99,42.67 49.99,49.99 5.64,49.99 0,49.99
  pour Bottom (rank 2): 0,0 49.99,0 49.99,42.67 49.99,49.99 5.64,49.99 0,49.99
I2C_SCL  (via drill 0.3)
  Top 0.152: v24.84,6.25 R8.1 26.36,5.64 33.53,5.64 v34.75,6.86 | v22.4,19.81 21.79,20.42 17.53,20.42 16.92,21.03 16.92,23.77 15.85,24.84 15.85,25.91 v14.17,27.58 | U9.13 5.71,23.39 4.57,24.54 4.57,26.52 v5.49,27.43
  Bottom 0.152: v22.4,19.81 22.52,19.7 IC1.61 22.52,17.72 23.32,16.92 23.32,7.77 v24.84,6.25 | v14.17,27.58 14.17,27.89 12.19,29.87 10.67,29.87 8.38,27.58 5.64,27.58 v5.49,27.43 | U4.1 35.93,11.85 34.9,10.82 34.9,8.37 34.91,8.37 | TP5.TP 42.06,3.81 41.6,4.27 36.27,4.27 34.9,5.64 34.9,6.71 v34.75,6.86 34.91,7.02 34.91,8.37 | U5.23 34.91,8.37
I2C_SDA  (via drill 0.3)
  Top 0.152: R9.1 26.98,8.08 25.15,8.08 24.23,7.16 24.23,6.4 v24.08,6.25 24.99,5.33 34.44,5.33 v34.75,5.03 | v21.64,19.81 21.34,20.12 17.37,20.12 16.61,20.88 16.61,23.62 15.54,24.69 15.54,25.76 14.33,26.98 v13.72,26.98 | U9.14 5.64,23.01 4.27,24.38 v4.27,26.98 | v34.29,8.99 v36.42,8.99
  Bottom 0.152: v21.64,19.81 22.02,19.44 IC1.62 22.02,17.76 23.01,16.76 23.01,7.32 v24.08,6.25 | v13.72,26.98 13.56,27.13 13.56,28.04 12.04,29.57 10.82,29.57 8.53,27.28 6.1,27.28 5.64,26.82 4.42,26.82 v4.27,26.98 | U4.3 36,13.75 34.59,12.34 34.59,9.3 v34.29,8.99 34.59,8.69 34.59,7.47 34.14,7.01 34.14,6.71 34.59,6.25 34.59,5.18 v34.75,5.03 35.05,5.03 36.12,3.96 39.32,3.96 39.47,3.81 TP1.TP | U5.24 36.64,8.77 v36.42,8.99
KEY_1  (via drill 0.3)
  Top 0.152: K1.SW1 21.18,30.48 21.49,30.79 R22.1 21.99,31.14 22.25,31.39 23.32,31.39 24.23,30.48 24.23,22.71 24.54,22.4 25.31,22.4 v25.61,22.7
  Bottom 0.152: v25.61,22.7 25.15,22.24 25.15,20.27 25.02,20.14 IC1.56
KEY_2  (via drill 0.3)
  Top 0.152: v27.74,27.28 27.89,27.28 30.48,29.87 30.48,30.94 v30.63,31.09
  Bottom 0.152: IC1.27 26.02,29 v27.74,27.28 | K2.SW1 38.46,29.57 31.55,29.57 30.63,30.48 v30.63,31.09 30.63,31.39 31.7,32.46 31.7,33.53 30.94,34.29 29.72,34.29 R23.1
KEY_3  (via drill 0.3)
  Top 0.152: v24.84,7.01 24.84,7.32 25.3,7.77 26.37,7.77 R24.1 | v23.93,9.45 23.93,9.75 22.61,11.07 K3.1 K3.3 21.62,17.85 v20.27,19.2
  Bottom 0.152: v24.84,7.01 23.93,7.92 v23.93,9.45 | IC1.2 19.84,21.16 20.57,20.42 20.57,19.51 v20.27,19.2
KEY_4  (via drill 0.3)
  Top 0.152: R25.1 30.48,8.99 30.13,9.34 K4.1 31.61,11.07 v31.67,11.12 | v30.63,14.17 30.13,14.68 K4.3 29.31,16.87 25.76,20.42 v24.08,20.42
  Bottom 0.152: v30.63,14.17 31.67,13.14 v31.67,11.12 | IC1.3 19.79,21.66 21.03,20.42 v24.08,20.42
KEY_5  (via drill 0.3)
  Top 0.152: v23.47,21.03 24.23,21.03 24.54,20.73 26.36,20.73 v26.67,20.42 | v35.81,17.37 37.03,16.15 38.41,16.15 38.64,16.39 K5.3 38.64,15.17 38.09,14.62 | v37.65,14.62 38.09,14.62 | 38.09,14.62 38.1,14.62 38.64,14.09 K5.1
  Bottom 0.152: IC1.4 19.75,22.16 21.18,20.73 23.01,20.73 23.32,21.03 v23.47,21.03 | v26.67,20.42 27.89,20.42 30.18,18.14 35.05,18.14 v35.81,17.37 | v37.65,14.62 37.96,14.94 R26.1
LED_1  (via drill 0.3)
  Top 0.152: v19.96,31.09 20.57,31.7 20.57,33.98 19.96,34.59 19.96,36.27 19.51,36.73 v18.9,36.73
  Bottom 0.152: IC1.22 23.52,29.31 22.4,28.19 21.06,28.19 19.96,29.29 v19.96,31.09 | Q3.1 18.94,36.77 v18.9,36.73
LED_2  (via drill 0.3)
  Top 0.152: v26.52,26.98 26.52,26.52 26.98,26.06 27.74,26.06 28.65,26.98 28.65,27.13 31.09,29.57 31.09,30.34 32,31.25 32,33.22 30.48,34.75 v30.48,34.9
  Bottom 0.152: IC1.23 24.02,29.32 26.36,26.98 v26.52,26.98 | v30.48,34.9 30.59,35.01 Q4.1
LED_3  (via drill 0.3)
  Top 0.152: v33.53,26.06 34.59,27.13 34.59,28.96 35.2,29.57 36.12,29.57 37.34,28.35 40.23,28.35 40.84,28.96 41.15,28.96 43.43,31.24 43.43,34.14 v43.28,34.29
  Bottom 0.152: v33.53,26.06 33.22,25.76 33.22,19.66 33.53,19.36 33.53,18.75 33.22,18.44 30.32,18.44 27.73,21.03 26.52,21.03 26.06,20.57 26.06,20.12 26.36,19.81 27.74,19.81 28.02,19.53 IC1.50 | v43.28,34.29 43.54,34.55 Q5.1
LED_4  (via drill 0.3)
  Top 0.152: v25.6,19.81 23.93,19.81 23.01,20.73 17.68,20.73 17.22,21.18 17.22,23.93 16.15,24.99 16.15,26.06 15.39,26.82 v15.39,27.13 | v5.18,35.66 5.79,35.05 6.86,35.05 7.62,34.29 7.62,32.46 7.77,32.31 7.77,31.24 v8.84,30.18
  Bottom 0.152: IC1.55 25.52,19.72 v25.6,19.81 | v15.39,27.13 15.24,27.28 15.24,27.74 12.5,30.48 9.14,30.48 v8.84,30.18 | v5.18,35.66 5.14,35.62 Q6.1
LED_B  (via drill 0.3)
  Top 0.152: v31.7,22.4 31.09,22.4 30.18,23.32 30.18,28.19 31.7,29.72 v31.7,30.18
  Bottom 0.152: IC1.44 31.44,22.66 v31.7,22.4 | R15.1 31.7,30.33 v31.7,30.18
LED_G  (via drill 0.3)
  Top 0.152: v31.7,23.16 30.79,23.16 30.48,23.47 30.48,28.04 32.46,30.02 v32.46,30.18
  Bottom 0.152: IC1.43 v31.69,23.16 v31.7,23.16 | v32.46,30.18 32.77,29.87 36.58,29.87 38.71,32 39.97,32 40.88,31.09 41,31.09 41.45,30.64 R14.1
LED_R  (via drill 0.3)
  Top 0.152: v31.7,23.93 31.09,23.93 30.79,24.23 30.79,27.89 32.46,29.57 32.61,29.57 33.07,30.02 33.07,30.33 32.31,31.09 v32.31,33.68
  Bottom 0.152: IC1.42 31.43,23.66 v31.7,23.93 | v32.31,33.68 v32.31,33.67 R13.1
MCLK  (via drill 0.3)
  Top 0.152: v29.87,30.79 29.87,30.02 v29.26,29.41 | R21.1 v29.26,23.93
  Bottom 0.152: U8.15 27.61,36.39 27.89,36.12 27.89,33.38 29.87,31.39 v29.87,30.79 | v29.26,29.41 29.57,29.11 29.57,24.23 v29.26,23.93 29.49,24.16 IC1.41
MMC_CD  (via drill 0.3)
  Top 0.152: v32.92,19.05 32.46,18.59 32.46,16.92 v32.77,16.61 | v26.06,14.17 26.67,13.56 32.31,13.56 v32.92,14.17
  Bottom 0.152: IC1.35 31.67,27.16 32.92,25.91 v32.92,19.05 | v32.77,16.61 32.49,16.34 J2.10-1 32.92,14.96 v32.92,14.17 | J2.10 26.06,14.65 v26.06,14.17
MMC_CLK
  Bottom 0.152: IC1.53 26.52,17.38 27.13,16.76 27.89,16.76 28.5,16.15 28.5,12.19 30,10.69 30,10.6 arc90 30.27,10.34 30.41,10.34 arc-90 30.67,10.07 30.67,10.06 arc-90 30.41,9.79 29.6,9.79 arc90 29.34,9.52 29.34,9.51 arc90 29.6,9.24 30.41,9.24 arc-90 30.67,8.98 30.67,8.96 arc-90 30.41,8.7 29.6,8.7 arc90 29.34,8.43 29.34,8.42 arc90 29.6,8.15 30.41,8.15 arc-90 30.67,7.88 30.67,7.87 arc-90 30.41,7.61 29.6,7.61 arc90 29.34,7.34 29.34,7.33 arc90 29.6,7.06 30.41,7.06 arc-90 30.67,6.79 30.67,6.78 arc-90 30.41,6.51 30.27,6.51 arc90 30,6.25 J2.5
MMC_CMD
  Bottom 0.152: IC1.54 26.02,17.42 26.98,16.46 27.74,16.46 28.19,16 28.19,14.02 27.8,13.63 27.8,11.46 arc90 28.07,11.2 28.75,11.2 arc-90 29.02,10.93 29.02,10.93 arc-90 28.75,10.66 28.07,10.66 arc90 27.8,10.39 27.8,10.39 arc90 28.07,10.12 28.75,10.12 arc-90 29.02,9.85 29.02,9.85 arc-90 28.75,9.58 28.07,9.58 arc90 27.8,9.32 27.8,9.31 arc90 28.07,9.04 28.75,9.04 arc-90 29.02,8.78 29.02,8.77 arc-90 28.75,8.51 28.07,8.51 arc90 27.8,8.24 27.8,8.23 arc90 28.07,7.97 28.75,7.97 arc-90 29.02,7.7 29.02,7.7 arc-90 28.75,7.43 28.07,7.43 arc90 27.8,7.16 J2.3
MMC_D0  (via drill 0.3)
  Top 0.152: v31.55,19.05 31.55,14.33 v31.39,14.17
  Bottom 0.152: IC1.39 31.69,25.16 32.61,24.23 32.61,19.51 32.16,19.05 v31.55,19.05 | v31.39,14.17 32.2,13.36 J2.7
MMC_D1  (via drill 0.3)
  Top 0.152: v32,19.66 32,19.51 32.16,19.36 v32.16,14.17
  Bottom 0.152: IC1.40 31.73,24.66 32.31,24.08 32.31,20.12 32,19.81 v32,19.66 | v32.16,14.17 33.3,13.03 33.3,8.38 arc-90 33.04,8.12 33.02,8.12 arc90 32.75,7.85 32.75,7.83 arc90 33.02,7.57 33.04,7.57 arc-90 33.3,7.3 33.3,7.29 arc-90 33.04,7.02 33.02,7.02 arc90 32.75,6.75 32.75,6.74 arc90 33.02,6.47 33.04,6.47 arc-90 33.3,6.21 J2.8
MMC_D2  (via drill 0.3)
  Top 0.152: v29.41,14.94 29.26,14.78 27.43,14.78 v26.82,14.17
  Bottom 0.152: IC1.51 27.52,17.59 27.74,17.37 28.19,17.37 29.11,16.46 29.11,15.24 v29.41,14.94 | v26.82,14.17 25.6,12.95 25.6,12.79 arc90 25.87,12.53 26.04,12.53 arc-90 26.31,12.26 26.31,12.25 arc-90 26.04,11.98 25.87,11.98 arc90 25.6,11.71 25.6,11.7 arc90 25.87,11.43 26.04,11.43 arc-90 26.31,11.17 26.31,11.15 arc-90 26.04,10.89 25.87,10.89 arc90 25.6,10.62 25.6,10.61 arc90 25.87,10.34 26.04,10.34 arc-90 26.31,10.07 26.31,10.06 arc-90 26.04,9.79 25.87,9.79 arc90 25.6,9.53 25.6,9.51 arc90 25.87,9.25 26.04,9.25 arc-90 26.31,8.98 26.31,8.97 arc-90 26.04,8.7 25.87,8.7 arc90 25.6,8.43 25.6,8.42 arc90 25.87,8.15 26.04,8.15 arc-90 26.31,7.89 26.31,7.88 arc-90 26.04,7.61 25.87,7.61 arc90 25.6,7.34 25.6,7.33 arc90 25.87,7.06 26.04,7.06 arc-90 26.31,6.79 26.31,6.78 arc-90 26.04,6.51 25.87,6.51 arc90 25.6,6.25 J2.1
MMC_D3  (via drill 0.3)
  Top 0.152: v29.11,14.17 v27.58,14.17
  Bottom 0.152: IC1.52 27.02,17.49 27.43,17.07 28.04,17.07 28.8,16.31 28.8,14.48 v29.11,14.17 | v27.58,14.17 26.7,13.29 26.7,12.99 arc90 26.97,12.72 27.22,12.72 arc-90 27.49,12.46 27.49,12.45 arc-90 27.22,12.19 26.97,12.19 arc90 26.7,11.92 26.7,11.92 arc90 26.97,11.65 27.22,11.65 arc-90 27.49,11.38 27.49,11.38 arc-90 27.22,11.11 26.97,11.11 arc90 26.7,10.85 26.7,10.84 arc90 26.97,10.58 27.22,10.58 arc-90 27.49,10.31 27.49,10.31 arc-90 27.22,10.04 26.97,10.04 arc90 26.7,9.77 26.7,9.77 arc90 26.97,9.5 27.22,9.5 arc-90 27.49,9.24 27.49,9.23 arc-90 27.22,8.97 26.97,8.97 arc90 26.7,8.7 26.7,8.7 arc90 26.97,8.43 27.22,8.43 arc-90 27.49,8.16 27.49,8.16 arc-90 27.22,7.89 26.97,7.89 arc90 26.7,7.63 26.7,7.62 arc90 26.97,7.36 27.22,7.36 arc-90 27.49,7.09 27.49,7.09 arc-90 27.22,6.82 26.97,6.82 arc90 26.7,6.55 J2.2
MPU_INT  (via drill 0.3)
  Top 0.152: v25.3,14.17 v25.31,14.17 26.22,13.26 33.98,13.26 v36.58,15.85 | v40.08,15.85 40.39,15.54 40.39,10.52 41.3,9.6 v41.3,7.01
  Bottom 0.152: IC1.58 24.02,15 24.84,14.17 v25.3,14.17 | U5.12 41.06,6.77 v41.3,7.01 | v40.08,15.85 v36.58,15.85
N$1  (via drill 0.3)
  Top 0.152: v22.86,42.22 R32.2
  Bottom 0.152: J3.A5 22.94,42.29 v22.86,42.22
N$4  (via drill 0.3)
  Top 0.152: v24.23,41.76 24.38,41.6 25.45,41.6 v25.6,41.76
  Bottom 0.152: J3.B7 24.44,41.97 v24.23,41.76 24.29,41.7 U8.4 | J3.A7 25.44,42.53 25.6,42.37 v25.6,41.76
N$5  (via drill 0.3)
  Top 0.152: v24.99,42.22 24.84,42.37 23.77,42.37 v23.62,42.22
  Bottom 0.152: J3.B6 24.94,42.27 v24.99,42.22 24.79,42.01 U8.5 | J3.A6 23.94,42.53 v23.62,42.22
N$6  (via drill 0.3)
  Top 0.152: v26.36,42.22 R31.2
  Bottom 0.152: J3.B5 25.94,42.64 v26.36,42.22
N$8  (via drill 0.3)
  Top 0.152: v45.41,26.98 44.96,27.43 44.04,27.43 43.58,27.89 C9.2 43.58,27.88 42.98,27.28 42.98,26.36 42.37,25.76 40.69,25.76 40.46,25.53 Q1.P$3
  Bottom 0.152: U2.3 44.16,25.72 v45.41,26.98
N$9  (via drill 0.3)
  Top 0.152: v45.41,25.45 45.41,25.76 44.96,26.21 43.59,26.21 | 43.59,26.21 43.28,26.21 42.98,25.91 42.98,22.55 42.82,22.4 Q1.P$1 | C7.2 43.59,26.21
  Bottom 0.152: v45.41,25.45 45.18,25.22 U2.4
N$10
  Top 0.152: U9.24 8.53,18.75 C51.1
N$11
  Bottom 0.152: D4.CA 44.22,29.59 44.5,29.87 44.5,33.57 Q5.2
N$12  (via drill 0.3)
  Top 0.152: J4.3 20.18,7.99 v20.42,8.23 | v13.87,20.88 13.34,21.41 U9.33
  Bottom 0.152: v20.42,8.23 20.12,8.53 20.12,17.07 19.81,17.37 15.24,17.37 14.17,18.44 14.17,19.36 14.02,19.51 14.02,20.73 v13.87,20.88
N$13  (via drill 0.3)
  Top 0.152: U9.31 11.63,20.22 v11.89,19.96 | J4.2 10.67,16.19 v10.67,16.61
  Bottom 0.152: v11.89,19.96 12.19,19.66 12.19,18.75 10.67,17.22 v10.67,16.61
N$15  (via drill 0.3)
  Top 0.152: R7.1 43.28,29.87 v41.76,28.35
  Bottom 0.152: U2.55 41.46,28.05 v41.76,28.35
N$16  (via drill 0.3)
  Top 0.152: D1.R 38.41,42.19 v38.41,41.15 38.71,40.84 40.08,40.84 43.13,37.8 R1.2
N$17  (via drill 0.3)
  Top 0.152: R29.2 C51.2 v9.45,16.15 9.75,15.85 9.75,2.59 10.47,1.87 J4.1 | U9.34 13.72,21.79 v13.87,21.64
  Bottom 0.152: v13.87,21.64 12.5,20.27 12.5,18.59 11.28,17.37 11.28,16.46 10.82,16 9.6,16 v9.45,16.15
N$18
  Top 0.152: U9.23 8.15,18.22 R29.1
N$19
  Top 0.152: U9.28 10.13,5.87 R30.1
N$20  (via drill 0.3)
  Top 0.152: U9.18 U9.19 U9.20 6.66,19.91 v6.55,19.81 | U9.18 U9.17 | U9.25 8.94,19.25 v9.14,19.05 | C53.1 5.57,21.41 U9.18
  Bottom 0.152: v9.14,19.05 8.99,18.9 7.47,18.9 v6.55,19.81
N$21
  Top 0.152: U9.22 7.75,18.72 C50.1
N$23
  Top 0.152: U9.36 13.65,22.61 C48.1
N$24  (via drill 0.3)
  Top 0.152: v21.03,22.25 20.8,22.48 C28.2 20.19,22.91 19.72,23.38 Q2.1
  Bottom 0.152: IC1.5 20.62,22.66 v21.03,22.25
N$25
  Top 0.152: U9.38 12.42,23.39 13.85,24.83 C48.2
N$26  (via drill 0.3)
  Top 0.152: v22.4,22.55 22.71,22.55 22.86,22.71 22.86,24.54 22.73,24.67 C31.2 22.21,24.78 Q2.3
  Bottom 0.152: IC1.6 21.8,23.16 v22.4,22.55
N$28
  Bottom 0.203: Q6.2 6.25,32.81 D5.CA
N$29  (via drill 0.3)
  Top 0.203: v27.74,28.04 C40.2
  Bottom 0.203: IC1.30 27.52,28.26 v27.74,28.04
N$30  (via drill 0.3)
  Top 0.152: D1.G 36.58,41.45 v36.88,41.15 37.8,40.23 39.78,40.23 42.67,37.34 42.67,36.58 43.28,35.97 R2.2
N$32
  Bottom 0.152: U8.13 27.64,37.39 27.81,37.56 R28.1
N$34
  Bottom 0.203: D2.2 18.41,38.85 Q3.2
N$37
  Bottom 0.203: U8.3 23.79,40.83 23.32,41.3 22.4,41.3 22.1,41 20.71,41 R27.2
N$38
  Top 0.152: U9.35 14.92,22.2 C41.1
N$39
  Bottom 0.203: Q4.2 32.42,36.66 D3.2
N$41  (via drill 0.3)
  Top 0.152: D1.B 37.48,41.31 v37.64,41.15 38.25,40.54 39.93,40.54 42.98,37.49 42.98,37.03 43.13,36.88 R3.2
N$42  (via drill 0.3)
  Top 0.203: v43.43,44.04 C26.2 C25.2 45.26,41.91 v45.57,41.6
  Bottom 0.203: J1.1 35.73,45.18 36.42,45.87 41.91,45.87 43.43,44.35 v43.43,44.04 | U6.1 45.53,41.64 v45.57,41.6 46.18,41 46.18,40.39 45.53,39.74 U6.3
N$47
  Bottom 0.152: U5.10 41.1,7.57 41.15,7.62 C20.2
N$52  (via drill 0.3)
  Top 0.152: R4.1 45.26,23.77 v45.41,23.93
  Bottom 0.152: U2.6 45.12,24.22 v45.41,23.93
N$53  (via drill 0.3)
  Top 0.152: R5.1 44.96,20.73 v45.41,21.18
  Bottom 0.152: U2.11 44.88,21.72 v45.41,21.18
N$54  (via drill 0.3)
  Top 0.152: v45.41,24.69 C18.2 C16.2 | v45.72,30.48 44.96,31.24 44.96,32.46 44.81,32.61 L1.1
  Bottom 0.152: U2.5 45.38,24.72 v45.41,24.69 46.02,25.3 46.02,30.18 v45.72,30.48
N$55  (via drill 0.3)
  Top 0.152: C21.2 C22.2 45.26,22.55 v45.41,22.4 46.02,21.79 46.02,21.03 45.57,20.57 45.26,20.57 L2.1
  Bottom 0.152: U2.9 44.79,22.72 45.11,22.4 v45.41,22.4
N$56
  Bottom 0.152: U2.13 43.44,20.72 44.05,20.11 R6.2
RGB_B  (via drill 0.3)
  Top 0.152: v39.32,34.29 39.62,34.59 v39.62,35.97 v39.62,37.19 | v31.39,41.15 30.79,41.15 28.19,43.74 21.03,43.74 19.36,42.06 12.95,42.06 v10.67,39.78 10.67,36.12 v11.28,35.51
  Bottom 0.152: D2.1 10.67,39.7 v10.67,39.78 | R15.2 33.99,30.18 36.42,30.18 39.32,33.07 v39.32,34.29 41.15,34.29 41.91,33.53 41.91,32.46 42.98,31.39 D4.B | D3.1 39.09,35.97 v39.62,35.97 | v39.62,37.19 39.32,37.49 39.32,39.47 38.25,40.54 32,40.54 v31.39,41.15 | D5.B 7.17,30.49 8.08,31.39 9.45,31.39 10.97,32.92 10.97,35.2 v11.28,35.51
RGB_G  (via drill 0.3)
  Top 0.152: v11.28,36.27 11.28,39.93 13.11,41.76 19.51,41.76 21.18,43.43 28.04,43.43 31.09,40.39 v31.39,40.39 | v41.91,31.7 42.22,32 42.22,33.83 41,35.05 v41,35.97
  Bottom 0.152: D2.4 11.28,37.11 v11.28,36.27 10.67,35.66 10.67,33.07 9.3,31.7 7.92,31.7 7.61,31.39 D5.G | D4.G R14.2 42.37,31.24 v41.91,31.7 | v41,35.97 40.39,35.97 39.78,36.58 39.47,36.58 39.01,37.03 39.01,39.32 38.79,39.55 | v31.39,40.39 31.55,40.23 38.1,40.23 38.79,39.55 | D3.4 37.94,38.7 38.79,39.55
RGB_R  (via drill 0.3)
  Top 0.152: v16.76,36.27 16.76,40.23 17.98,41.45 19.66,41.45 21.34,43.13 27.89,43.13 30.79,40.23 v30.79,38.71 30.79,35.97 v32.31,34.44
  Bottom 0.152: D2.3 16.76,37.01 v16.76,36.27 16.46,35.97 12.5,35.97 11.28,34.75 11.28,32.77 9.6,31.09 8.23,31.09 7.32,30.18 7.32,29.87 7.03,29.59 D5.R | D4.R 42.54,32.29 42.22,32.61 42.22,33.68 41,34.9 37.03,34.9 36.58,35.36 34.59,35.36 33.84,34.6 R13.2 32.47,34.6 v32.31,34.44 | D3.3 32.95,38.71 v30.79,38.71
SRST_N  (via drill 0.3)
  Top 0.152: v26.52,33.53 R12.1 | R12.1 26.61,32.71 C39.2 | R12.1 25.91,32.01 25.91,26.67 v27.13,25.45 27.89,24.69 29.26,24.69 29.87,24.08 29.87,23.16 31.09,21.95 31.09,21.49 31.55,21.03 31.85,21.03 33.68,19.2 35.51,19.2 v36.12,18.59 | v11.43,25.76 10.36,25.76 10.13,25.53 U9.3
  Bottom 0.152: U8.17 26.29,34.67 26.52,34.44 v26.52,33.53 | v36.12,18.59 36.73,17.98 39.78,17.98 40.23,18.44 40.23,18.75 39.96,19.02 U2.19 | v27.13,25.45 25.6,23.93 20.42,23.93 20.15,23.66 IC1.7 18.1,23.66 17.53,24.23 16,24.23 13.87,26.36 12.04,26.36 v11.43,25.76
SWCLK
  Bottom 0.152: U2.12 43.4,21.22 44.65,19.96 44.65,18.9 44.35,18.59 42.67,18.59 41.45,17.37 36.58,17.37 35.97,16.76 35.66,16.76 34.59,17.83 30.02,17.83 29.19,18.66 IC1.49
SWDIO  (via drill 0.3)
  Top 0.152: v31.7,21.64 33.53,19.81 v33.83,19.81
  Bottom 0.152: IC1.46 31.68,21.66 v31.7,21.64 | U2.14 42.65,19.2 | 42.65,19.2 42.65,19.02 41.3,17.68 36.27,17.68 35.51,18.44 34.14,18.44 33.83,18.75 v33.83,19.81 | R6.1 42.65,19.2
ULPI_CLK  (via drill 0.3)
  Top 0.152: v21.18,35.05 20.88,34.75 20.88,34.14 arc90 21.14,33.87 21.83,33.87 arc-90 22.1,33.6 22.1,33.58 arc-90 21.83,33.31 21.14,33.31 arc90 20.88,33.04 20.88,33.02 arc90 21.14,32.75 21.83,32.75 arc-90 22.1,32.48 22.1,32.45 arc-90 21.83,32.19 21.14,32.19 arc90 20.88,31.92 20.88,31.85 21.18,31.55 v21.49,31.55
  Bottom 0.152: U8.27 21.5,36.89 21.03,36.42 21.03,35.2 v21.18,35.05 | IC1.21 23.02,30.93 22.86,31.09 21.95,31.09 v21.49,31.55
ULPI_D0
  Bottom 0.152: U8.1 21.63,40.07 21.34,39.78 21.03,39.78 19.66,38.41 19.66,34.44 20.57,33.53 20.57,31.7 21.02,31.26 IC1.17
ULPI_D1
  Bottom 0.152: U8.32 21.11,39.39 19.96,38.25 19.96,34.59 20.88,33.68 20.88,33.07 22.55,31.39 24.84,31.39 25.02,31.22 IC1.25
ULPI_D2
  Bottom 0.152: U8.31 21.06,38.89 20.27,38.1 20.27,34.75 21.18,33.83 21.18,33.22 22.71,31.7 25.15,31.7 25.52,31.33 IC1.26
ULPI_D3
  Bottom 0.152: U8.28 21.54,37.39 20.57,36.42 20.57,34.9 21.49,33.98 21.49,33.38 22.86,32 26.06,32 26.52,31.55 IC1.28
ULPI_D4
  Bottom 0.152: U8.26 21.46,36.39 21.34,36.27 21.34,35.66 21.79,35.2 21.79,33.53 23.01,32.31 26.21,32.31 27.02,31.51 IC1.29
ULPI_D5
  Bottom 0.152: U8.25 22.11,33.67 23.16,32.61 27.74,32.61 28.96,31.39 28.96,30.48 30.52,28.92 IC1.33
ULPI_D6
  Bottom 0.152: U8.24 22.79,34.52 22.86,34.44 22.86,33.38 23.32,32.92 27.89,32.92 29.26,31.55 29.26,30.63 31.39,28.5 31.39,27.74 31.32,27.66 IC1.34
ULPI_D7  (via drill 0.3)
  Top 0.152: v23.47,33.53 24.54,32.46 24.54,23.32 v24.84,23.01
  Bottom 0.152: U8.23 23.29,34.56 23.16,34.44 23.16,33.83 v23.47,33.53 | v24.84,23.01 24.84,20.42 24.52,20.09 IC1.57
ULPI_DIR  (via drill 0.3)
  Top 0.152: v25.76,33.53 25.6,33.38 25.6,26.52 26.06,26.06 v26.06,25.15
  Bottom 0.152: U8.19 25.29,34 v25.76,33.53 | v26.06,25.15 26.05,25.16 IC1.10
ULPI_NXT  (via drill 0.3)
  Top 0.152: v24.23,33.53 24.84,32.92 24.84,26.06 v25.15,25.76
  Bottom 0.152: U8.21 24.29,34.54 24.38,34.44 24.38,33.68 v24.23,33.53 | IC1.11 25.05,25.66 v25.15,25.76
ULPI_STP  (via drill 0.3)
  Top 0.152: v24.99,33.53 25.15,33.38 25.15,26.52 25.76,25.91 25.76,25.6 25.15,24.99 v25.15,24.54
  Bottom 0.152: U8.20 24.79,33.73 v24.99,33.53 | v25.15,24.54 20.42,24.54 20.05,24.16 IC1.8
VUSB18  (via drill 0.3)
  Top 0.203: v25.91,34.29 26.21,34.59 C46.2
  Bottom 0.203: U8.18 25.79,34.41 v25.91,34.29
VUSB33  (via drill 0.3)
  Top 0.203: v21.18,40.39 v21.18,38.25 21.18,36.42 22.37,35.23 C45.2 23.32,35.23 | v27.89,36.88 27.89,36.42 26.7,35.23 23.32,35.23 | v23.77,34.29 23.77,34.78 23.32,35.23
  Bottom 0.203: U8.2 23.29,40.72 23.16,40.84 22.55,40.84 22.25,40.54 21.34,40.54 v21.18,40.39 | U8.30 21.32,38.39 v21.18,38.25 | U8.22 23.79,34.3 v23.77,34.29 | U8.14 27.88,36.89 v27.89,36.88

## Text on the board
tNames: zhiyb @20191215 | Revision 1.3
bNames: V | G | G | D | C